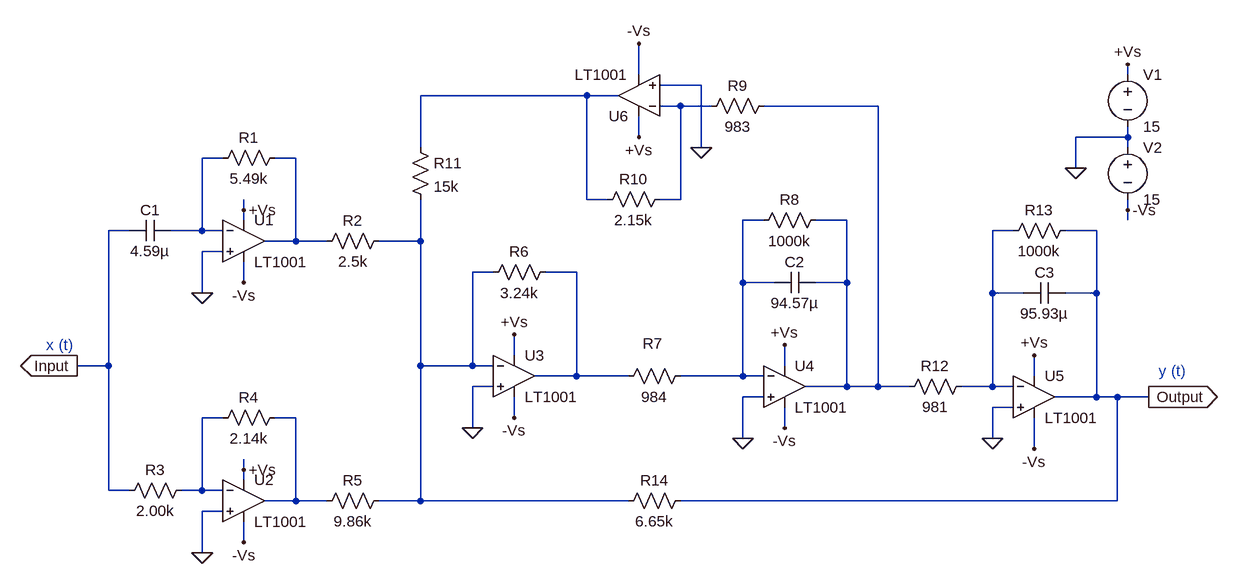
[diagram p0: schematic LTspice Terrain Schematic.asc]
LTspice Terrain Schematic.asc, the LTspice schematic file:
Version 4
SHEET 1 1420 1044
WIRE 112 -128 112 -176
WIRE 864 -128 864 -144
WIRE 208 -112 144 -112
WIRE 32 -96 -224 -96
WIRE 80 -96 32 -96
WIRE 176 -80 144 -80
WIRE 224 -80 176 -80
WIRE 480 -80 304 -80
WIRE 112 -32 112 -64
WIRE 864 -32 864 -48
WIRE 864 -32 784 -32
WIRE -224 -16 -224 -96
WIRE 208 -16 208 -112
WIRE 864 -16 864 -32
WIRE -528 0 -560 0
WIRE -416 0 -448 0
WIRE 784 16 784 -32
WIRE 32 64 32 -96
WIRE 64 64 32 64
WIRE 176 64 176 -80
WIRE 176 64 144 64
WIRE -496 80 -496 64
WIRE 864 80 864 64
WIRE -496 96 -496 80
WIRE 304 96 272 96
WIRE 432 96 384 96
WIRE 864 96 864 80
WIRE -672 112 -704 112
WIRE -560 112 -560 0
WIRE -560 112 -608 112
WIRE -528 112 -560 112
WIRE 688 112 656 112
WIRE 816 112 768 112
WIRE -416 128 -416 0
WIRE -416 128 -464 128
WIRE -368 128 -416 128
WIRE -224 128 -224 64
WIRE -224 128 -288 128
WIRE -528 144 -560 144
WIRE -112 176 -144 176
WIRE 16 176 -32 176
WIRE -496 192 -496 160
WIRE 272 192 272 96
WIRE 320 192 272 192
WIRE 432 192 432 96
WIRE 432 192 384 192
WIRE -560 208 -560 144
WIRE 656 208 656 112
WIRE 704 208 656 208
WIRE 816 208 816 112
WIRE 816 208 768 208
WIRE -80 304 -80 272
WIRE -704 320 -704 112
WIRE -704 320 -752 320
WIRE -224 320 -224 128
WIRE -144 320 -144 176
WIRE -144 320 -224 320
WIRE -112 320 -144 320
WIRE 336 320 336 288
WIRE 16 336 16 176
WIRE 16 336 -48 336
WIRE 96 336 16 336
WIRE 272 336 272 192
WIRE 272 336 176 336
WIRE 304 336 272 336
WIRE 720 336 720 304
WIRE -112 352 -144 352
WIRE 432 352 432 192
WIRE 432 352 368 352
WIRE 480 352 480 -80
WIRE 480 352 432 352
WIRE 528 352 480 352
WIRE 656 352 656 208
WIRE 656 352 608 352
WIRE 688 352 656 352
WIRE 304 368 272 368
WIRE 816 368 816 208
WIRE 816 368 752 368
WIRE 848 368 816 368
WIRE 896 368 848 368
WIRE 688 384 656 384
WIRE -528 400 -560 400
WIRE -416 400 -448 400
WIRE -80 400 -80 368
WIRE -144 416 -144 352
WIRE 336 416 336 384
WIRE 272 432 272 368
WIRE 656 432 656 384
WIRE 720 448 720 400
WIRE -496 480 -496 464
WIRE -496 496 -496 480
WIRE -704 512 -704 320
WIRE -672 512 -704 512
WIRE -560 512 -560 400
WIRE -560 512 -592 512
WIRE -528 512 -560 512
WIRE -416 528 -416 400
WIRE -416 528 -464 528
WIRE -368 528 -416 528
WIRE -224 528 -224 320
WIRE -224 528 -288 528
WIRE 96 528 -224 528
WIRE 848 528 848 368
WIRE 848 528 176 528
WIRE -528 544 -560 544
WIRE -496 592 -496 560
WIRE -560 608 -560 544
FLAG 208 -16 0
FLAG -144 416 0
FLAG 272 432 0
FLAG 656 432 0
FLAG 896 368 Output
IOPIN 896 368 Out
FLAG -80 272 +Vs
FLAG -80 400 -Vs
FLAG 336 288 +Vs
FLAG 336 416 -Vs
FLAG 112 -32 +Vs
FLAG 112 -176 -Vs
FLAG 720 304 +Vs
FLAG 720 448 -Vs
FLAG 864 -144 +Vs
FLAG 864 80 -Vs
FLAG 784 16 0
FLAG -560 608 0
FLAG -496 480 +Vs
FLAG -496 592 -Vs
FLAG -752 320 Input
IOPIN -752 320 Out
FLAG -560 208 0
FLAG -496 80 +Vs
FLAG -496 192 -Vs
SYMBOL res 160 48 R90
WINDOW 0 0 56 VBottom 2
WINDOW 3 32 56 VTop 2
SYMATTR InstName R10
SYMATTR Value 2.15k
SYMBOL res 320 -96 R90
WINDOW 0 0 56 VBottom 2
WINDOW 3 32 56 VTop 2
SYMATTR InstName R9
SYMATTR Value 983
SYMBOL res -272 512 R90
WINDOW 0 0 56 VBottom 2
WINDOW 3 32 56 VTop 2
SYMATTR InstName R5
SYMATTR Value 9.86k
SYMBOL res -240 -32 R0
SYMATTR InstName R11
SYMATTR Value 15k
SYMBOL res -16 160 R90
WINDOW 0 0 56 VBottom 2
WINDOW 3 32 56 VTop 2
SYMATTR InstName R6
SYMATTR Value 3.24k
SYMBOL res 192 320 R90
WINDOW 0 -19 59 VBottom 2
WINDOW 3 32 56 VTop 2
SYMATTR InstName R7
SYMATTR Value 984
SYMBOL res 624 336 R90
WINDOW 0 0 56 VBottom 2
WINDOW 3 32 56 VTop 2
SYMATTR InstName R12
SYMATTR Value 981
SYMBOL cap 768 192 R90
WINDOW 0 0 32 VBottom 2
WINDOW 3 32 32 VTop 2
SYMATTR InstName C3
SYMATTR Value 95.93µ
SYMBOL OpAmps/LT1001 -80 272 R0
SYMATTR InstName U3
SYMBOL OpAmps/LT1001 336 288 R0
SYMATTR InstName U4
SYMBOL OpAmps/LT1001 720 304 R0
SYMATTR InstName U5
SYMBOL OpAmps/LT1001 112 -32 R180
SYMATTR InstName U6
SYMBOL cap 384 176 R90
WINDOW 0 0 32 VBottom 2
WINDOW 3 32 32 VTop 2
SYMATTR InstName C2
SYMATTR Value 94.57µ
SYMBOL res 400 80 R90
WINDOW 0 0 56 VBottom 2
WINDOW 3 32 56 VTop 2
SYMATTR InstName R8
SYMATTR Value 1000k
SYMBOL res 784 96 R90
WINDOW 0 0 56 VBottom 2
WINDOW 3 32 56 VTop 2
SYMATTR InstName R13
SYMATTR Value 1000k
SYMBOL voltage 864 -144 R0
SYMATTR InstName V1
SYMATTR Value 15
SYMBOL voltage 864 -32 R0
SYMATTR InstName V2
SYMATTR Value 15
SYMBOL res -544 416 R270
WINDOW 0 32 56 VTop 2
WINDOW 3 0 56 VBottom 2
SYMATTR InstName R4
SYMATTR Value 2.14k
SYMBOL res -576 496 R90
WINDOW 0 0 56 VBottom 2
WINDOW 3 32 56 VTop 2
SYMATTR InstName R3
SYMATTR Value 2.00k
SYMBOL OpAmps/LT1001 -496 464 R0
SYMATTR InstName U2
SYMBOL res 192 512 R90
WINDOW 0 0 56 VBottom 2
WINDOW 3 32 56 VTop 2
SYMATTR InstName R14
SYMATTR Value 6.65k
SYMBOL OpAmps/LT1001 -496 64 R0
SYMATTR InstName U1
SYMBOL cap -608 96 R90
WINDOW 0 0 32 VBottom 2
WINDOW 3 32 32 VTop 2
SYMATTR InstName C1
SYMATTR Value 4.59µ
SYMBOL res -544 16 R270
WINDOW 0 32 56 VTop 2
WINDOW 3 0 56 VBottom 2
SYMATTR InstName R1
SYMATTR Value 5.49k
SYMBOL res -272 112 R90
WINDOW 0 0 56 VBottom 2
WINDOW 3 32 56 VTop 2
SYMATTR InstName R2
SYMATTR Value 2.5k
TEXT 912 328 Left 2 ;y (t)
TEXT -800 288 Left 2 ;x (t)

The netlist it stands for:
* LTspice Terrain Schematic.asc
R10 N002 N001 2.15k
R9 N003 N002 983
R5 N008 N011 9.86k
R11 N001 N008 15k
R6 N009 N008 3.24k
R7 N006 N009 984
R12 N007 N003 981
C3 Output N007 95.93µ
XU3 0 N008 +Vs -Vs N009 LT1001  ; pins In+ In- V+ V- OUT
XU4 0 N006 +Vs -Vs N003 LT1001  ; pins In+ In- V+ V- OUT
XU5 0 N007 +Vs -Vs Output LT1001  ; pins In+ In- V+ V- OUT
XU6 0 N002 +Vs -Vs N001 LT1001  ; pins In+ In- V+ V- OUT
C2 N003 N006 94.57µ
R8 N003 N006 1000k
R13 Output N007 1000k
V1 +Vs 0 15
V2 0 -Vs 15
R4 N010 N011 2.14k
R3 N010 Input 2.00k
XU2 0 N010 +Vs -Vs N011 LT1001  ; pins In+ In- V+ V- OUT
R14 Output N008 6.65k
XU1 0 N004 +Vs -Vs N005 LT1001  ; pins In+ In- V+ V- OUT
C1 N004 Input 4.59µ
R1 N004 N005 5.49k
R2 N008 N005 2.5k
* y (t)
* x (t)
.lib LTC.lib
.backanno
.end